# EAGLE design 2_3 (EAGLE 9.6.2)
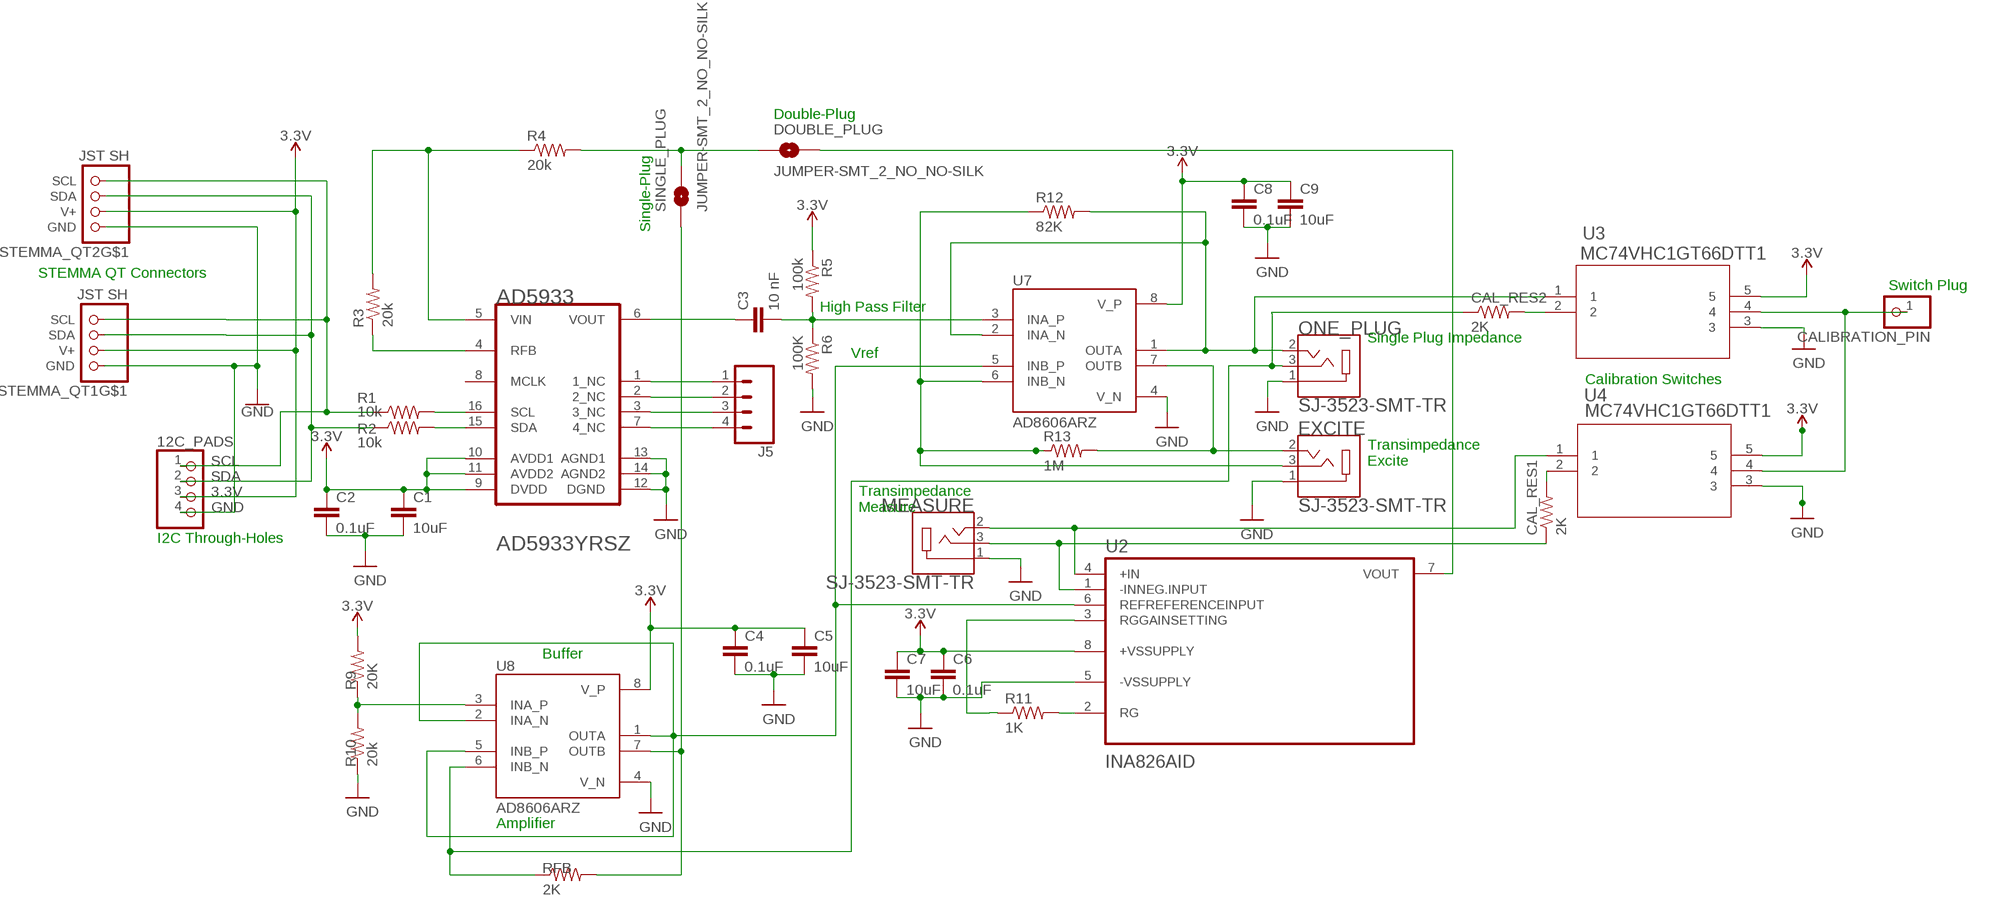
[diagram p0: schematic, sheet 1]

## Parts
12C_PADS  PINHD-1X4  [1X04]
AD5933  ANALOG_DEVICES_AD5933YRSZANALOG_DEVICES_AD5933YRSZ_0_0  [ANALOG_DEVICES_AD5933YRSZ_0]
C1  10uF  C-EUC0603  [C0603]
C2  0.1uF  C-EUC0603  [C0603]
C3  10 nF  C-EUC0603  [C0603]
C4  0.1uF  C-EUC0603  [C0603]
C5  10uF  C-EUC0603  [C0603]
C6  0.1uF  C-EUC0603  [C0603]
C7  10uF  C-EUC0603  [C0603]
C8  0.1uF  C-EUC0603  [C0603]
C9  10uF  C-EUC0603  [C0603]
CAL_RES1  2K  R-US_R0603  [R0603]
CAL_RES2  2K  R-US_R0603  [R0603]
CALIBRATION_PIN  PINHD-1X1  [1X01]
DOUBLE_PLUG  JUMPER-SMT_2_NO_NO-SILK  [SMT-JUMPER_2_NO_NO-SILK]
EXCITE  SJ-3523-SMT-TR  [CUI_SJ-3523-SMT-TR]
J5  CONN_04  [1X04]
MEASURE  SJ-3523-SMT-TR  [CUI_SJ-3523-SMT-TR]
ONE_PLUG  SJ-3523-SMT-TR  [CUI_SJ-3523-SMT-TR]
R1  10k  R-US_R0603  [R0603]
R2  10k  R-US_R0603  [R0603]
R3  20k  R-US_R0603  [R0603]
R4  20k  R-US_R0603  [R0603]
R5  100k  R-US_R0603  [R0603]
R6  100K  R-US_R0603  [R0603]
R9  20K  R-US_R0603  [R0603]
R10  20k  R-US_R0603  [R0603]
R11  1K  R-US_R0603  [R0603]
R12  82K  R-US_R0603  [R0603]
R13  1M  R-US_R0603  [R0603]
RFB  2K  R-US_R0603  [R0603]
SINGLE_PLUG  JUMPER-SMT_2_NO_NO-SILK  [SMT-JUMPER_2_NO_NO-SILK]
STEMMA_QT1  JST SH  STEMMA_I2C_QTRA  [JST_SH4_RA]
STEMMA_QT2  JST SH  STEMMA_I2C_QTRA  [JST_SH4_RA]
U2  INA826AID  [SOIC127P599X175-8N]
U3  MC74VHC1GT66DTT1  [TSOP5_1P65X3P15_ONS]
U4  MC74VHC1GT66DTT1  [TSOP5_1P65X3P15_ONS]
U7  AD8606ARZ  [SOIC127P600X175-8N]
U8  AD8606ARZ  [SOIC127P600X175-8N]

## Nets
3.3V: 12C_PADS.3 AD5933.9(DVDD) AD5933.10(AVDD1) AD5933.11(AVDD2) C1.1 C2.1 C4.1 C5.1 C6.1 C7.1 C8.1 C9.1 R5.1 R9.2 STEMMA_QT1.2(V+) STEMMA_QT2.2(V+) U2.8(+VSSUPPLY) U3.5 U4.5 U7.8(V_P) U8.8(V_P)
GND: 12C_PADS.4 AD5933.12(DGND) AD5933.13(AGND1) AD5933.14(AGND2) C1.2 C2.2 C4.2 C5.2 C6.2 C7.2 C8.2 C9.2 EXCITE.1 MEASURE.1 ONE_PLUG.1 R6.2 R10.1 STEMMA_QT1.1(GND) STEMMA_QT2.1(GND) U2.5(-VSSUPPLY) U3.3 U4.3 U7.4(V_N) U8.4(V_N)
N$1: AD5933.16(SCL) R1.2
N$2: AD5933.15(SDA) R2.2
N$3: AD5933.1(1_NC) J5.1
N$4: AD5933.2(2_NC) J5.2
N$5: AD5933.4(RFB) R3.1
N$6: AD5933.5(VIN) R3.2 R4.1
N$7: DOUBLE_PLUG.1 R4.2 SINGLE_PLUG.2
N$8: AD5933.6(VOUT) C3.1
N$9: C3.2 R5.2 R6.1 U7.3(INA_P)
N$10: AD5933.3(3_NC) J5.3
N$11: AD5933.7(4_NC) J5.4
N$12: RFB.2 SINGLE_PLUG.1 U8.7(OUTB)
N$13: U2.6(REFREFERENCEINPUT) U7.5(INB_P) U8.1(OUTA) U8.2(INA_N) U8.5(INB_P)
N$14: R9.1 R10.2 U8.3(INA_P)
N$15: ONE_PLUG.2 R12.2 U3.1 U7.1(OUTA) U7.2(INA_N)
N$16: R11.1 U2.3(RGGAINSETTING)
N$17: CAL_RES2.1 ONE_PLUG.3 RFB.1 U8.6(INB_N)
N$18: R11.2 U2.2(RG)
N$19: EXCITE.2 R13.2 U7.7(OUTB)
N$20: MEASURE.2 U2.4(+IN) U4.1
N$21: CAL_RES1.1 MEASURE.3 U2.1(-INNEG.INPUT)
N$22: CAL_RES2.2 U3.2
N$23: EXCITE.3 R12.1 R13.1 U7.6(INB_N)
N$24: CAL_RES1.2 U4.2
N$25: DOUBLE_PLUG.2 U2.7(VOUT)
N$27: CALIBRATION_PIN.1 U3.4 U4.4
SCL: 12C_PADS.1 R1.1 STEMMA_QT1.4(SCL) STEMMA_QT2.4(SCL)
SDA: 12C_PADS.2 R2.1 STEMMA_QT1.3(SDA) STEMMA_QT2.3(SDA)
Unconnected: AD5933.8(MCLK) STEMMA_QT1.MT1(MT) STEMMA_QT1.MT2(MT) STEMMA_QT2.MT1(MT) STEMMA_QT2.MT2(MT)

## Notes on the sheet
- Double-Plug
- Single-Plug
- STEMMA QT Connectors
- Switch Plug
- High Pass Filter
- Single Plug Impedance
- Vref
- Calibration Switches
- Transimpedance
  Excite
- Transimpedance
  Measure
- I2C Through-Holes
- Buffer
- Amplifier

## Library data of the parts
12C_PADS = pinhead:PINHD-1X4: PIN HEADER
AD5933 = Analog Devices - AD5933YRSZ:ANALOG_DEVICES_AD5933YRSZ: ADI-AD5933-RS-16; CIIVA_IDS: 19299999; CODE__JEDEC: MO-150-AC; COMPONENT_LINK_1_DESCRIPTION: Manufacturer URL; COMPONENT_LINK_1_URL: www.analog.com; COMPONENT_LINK_3_DESCRIPTION: Package Specification; COMPONENT_LINK_3_URL: http://www.analog.com/static/imported-files/packages/31572257652246RS_16.pdf; DATASHEET: http://www.analog.com/static/imported-files/data_sheets/AD5933.pdf; DATASHEET_VERSION: Rev. D; FOOTPRINT_VARIANT_NAME_0: Level C; FOOTPRINT_VARIANT_NAME_1: Level B; FOOTPRINT_VARIANT_NAME_2: Level A; IMPORTED: yes; IMPORTED_FROM: vault; IMPORT_TS: 1521848033; IO_INTERFACE: Serial; I_SUPPLY_TOTAL_MAX: 15mA; MASTER_FCLK: 16.776MHz; MF: Analog Devices; MPN: AD5933YRSZ; PACKAGE: RS-16; PACKAGE_DESCRIPTION: 16-Lead Shrink Small Outline Package [SSOP]; PACKAGE_VERSION: 3/17/2005; PIN_0_0_15_INSIDE_EDGE: clock; PIN_0_0_7_INSIDE_EDGE: clock; PREFIX: U; RELEASE_DATE: 1333437714; RESOLUTION_BITS: 12bit; TUNING_WORD_WIDTH_BITS: 27bit; VAULT_GUID: 12E548FF-7E75-4596-9B3A-06B167E4919E; VAULT_REVISION: 0B288880-7FBC-46A2-8187-17CED40A7223
C1-C9 = rcl:C-EU: CAPACITOR, European symbol; SPICEPREFIX: C
CAL_RES1 CAL_RES2 R1-R6 R9-R13 RFB = rcl:R-US_: RESISTOR, American symbol; SPICEPREFIX: R
CALIBRATION_PIN = pinhead:PINHD-1X1: PIN HEADER
DOUBLE_PLUG SINGLE_PLUG = SparkFun-Jumpers:JUMPER-SMT_2_NO: Normally open jumper This jumper has two pads in close proximity to each other. Apply solder to close the connection. Round pads are easier to solder for beginners, but are a lot larger. SparkFun Product that uses the round pads: SparkFun EL Sequencer <https://www.sparkfun.com/products/12781>
EXCITE MEASURE ONE_PLUG = SJ-3523-SMT-TR:SJ-3523-SMT-TR: Audio Jack Connector 3.5 mm Low Profile Surface Mount Stereo Jack, 3 Pin Right-Angle Check availability <https://pricing.snapeda.com/parts/SJ-3523-SMT-TR/CUI%20Devices/view-part?ref=eda>; AVAILABILITY: In Stock; CUI_PURCHASE_URL: https://www.cuidevices.com/product/interconnect/connectors/audio-connectors/jacks/sj-352x-smt-series?utm_source=snapeda.com&utm_medium=referral&utm_campaign=snapedaBOM; DESCRIPTION: 3.5 mm, Stereo, Right Angle, Surface Mount (SMT), 3 Conductors, 0~1 Internal Switches, Audio Jack Connector; MF: CUI Devices; MP: SJ-3523-SMT-TR; PACKAGE: None; PRICE: None; PURCHASE-URL: https://pricing.snapeda.com/search/part/SJ-3523-SMT-TR/?ref=eda
J5 = SparkFun-Connectors:CONN_04: Multi connection point. Often used as Generic Header-pin footprint for 0.1 inch spaced/style header connections On any of the 0.1 inch spaced packages, you can populate with these: Break Away Headers - Straight <https://www.sparkfun.com/products/116> (PRT-00116) Break Away Male Headers - Right Angle <https://www.sparkfun.com/products/553> (PRT-00553) Female Headers <https://www.sparkfun.com/products/115> (PRT-00115) Break Away Headers - Machine Pin <https://www.sparkfun.com/products/117> (PRT-00117) Break Away Female Headers - Swiss Machine Pin <https://www.sparkfun.com/products/743> (PRT-00743) For SCREWTERMINALS and SPRING TERMINALS visit here: Screw Terimnals on SparkFun.com <https://www.sparkfun.com/search/results?term=Screw+Terminals> (5mm/3.5mm/2.54mm spacing) This device is also useful as a general connection point to wire up your design to another part of your project. Our various solder wires solder well into these plated through hole pads. Hook-Up Wire - Assortment (Stranded, 22 AWG) <https://www.sparkfun.com/products/11375> (PRT-11375) Hook-Up Wire - Assortment (Solid Core, 22 AWG) <https://www.sparkfun.com/products/11367> (PRT-11367) View the entire wire category on our website here <https://www.sparkfun.com/categories/141> Special notes: Molex polarized connector foot print use with SKU : PRT-08231 with associated crimp pins and housings. 1MM SMD Version SKU: PRT-10208; PROD_ID: CONN-09696
STEMMA_QT1 STEMMA_QT2 = microbuilder:STEMMA_I2C
U2 = INA826AID:INA826AID: Check availability <https://pricing.snapeda.com/parts/INA826AID/Texas%20Instruments/view-part?ref=eda>; AVAILABILITY: In Stock; CHECK_PRICES: https://www.snapeda.com/parts/INA826AID/Texas+Instruments/view-part/?ref=eda; DESCRIPTION: Precision, 200-μA Supply Current, 36-V Supply Instrumentation Amplifier; MF: Texas Instruments; MP: INA826AID; PACKAGE: SOIC-8 Texas Instruments; PRICE: None; PURCHASE-URL: https://www.snapeda.com/api/url_track_click_mouser/?unipart_id=217743&manufacturer=Texas Instruments&part_name=INA826AID&search_term=None; SNAPEDA_LINK: https://www.snapeda.com/parts/INA826AID/Texas+Instruments/view-part/?ref=snap
U3 U4 = MC74VHC1GT66DTT1:MC74VHC1GT66DTT1; COPYRIGHT: Copyright (C) 2024 Ultra Librarian. All rights reserved.; MANUFACTURER_PART_NUMBER: MC74VHC1GT66DTT1; MFR_NAME: onsemi
U7 U8 = AD8606ARZ:AD8606ARZ: Operational amplifier; 10MHz; 2.7÷5VDC; Channels: 2; SO8 Check availability <https://pricing.snapeda.com/parts/AD8606ARZ/Analog%20Devices/view-part?ref=eda>; AVAILABILITY: In Stock; CHECK_PRICES: https://www.snapeda.com/parts/AD8606ARZ/Analog+Devices/view-part/?ref=eda; DESCRIPTION: Precision, Low Noise, RRIO, CMOS Op Amp (Dual); MF: Analog Devices; MP: AD8606ARZ; PACKAGE: SOIC-8 Analog Devices; PRICE: None; PURCHASE-URL: https://www.snapeda.com/api/url_track_click_mouser/?unipart_id=43414&manufacturer=Analog Devices&part_name=AD8606ARZ&search_term=None; SNAPEDA_LINK: https://www.snapeda.com/parts/AD8606ARZ/Analog+Devices/view-part/?ref=snap

## Board
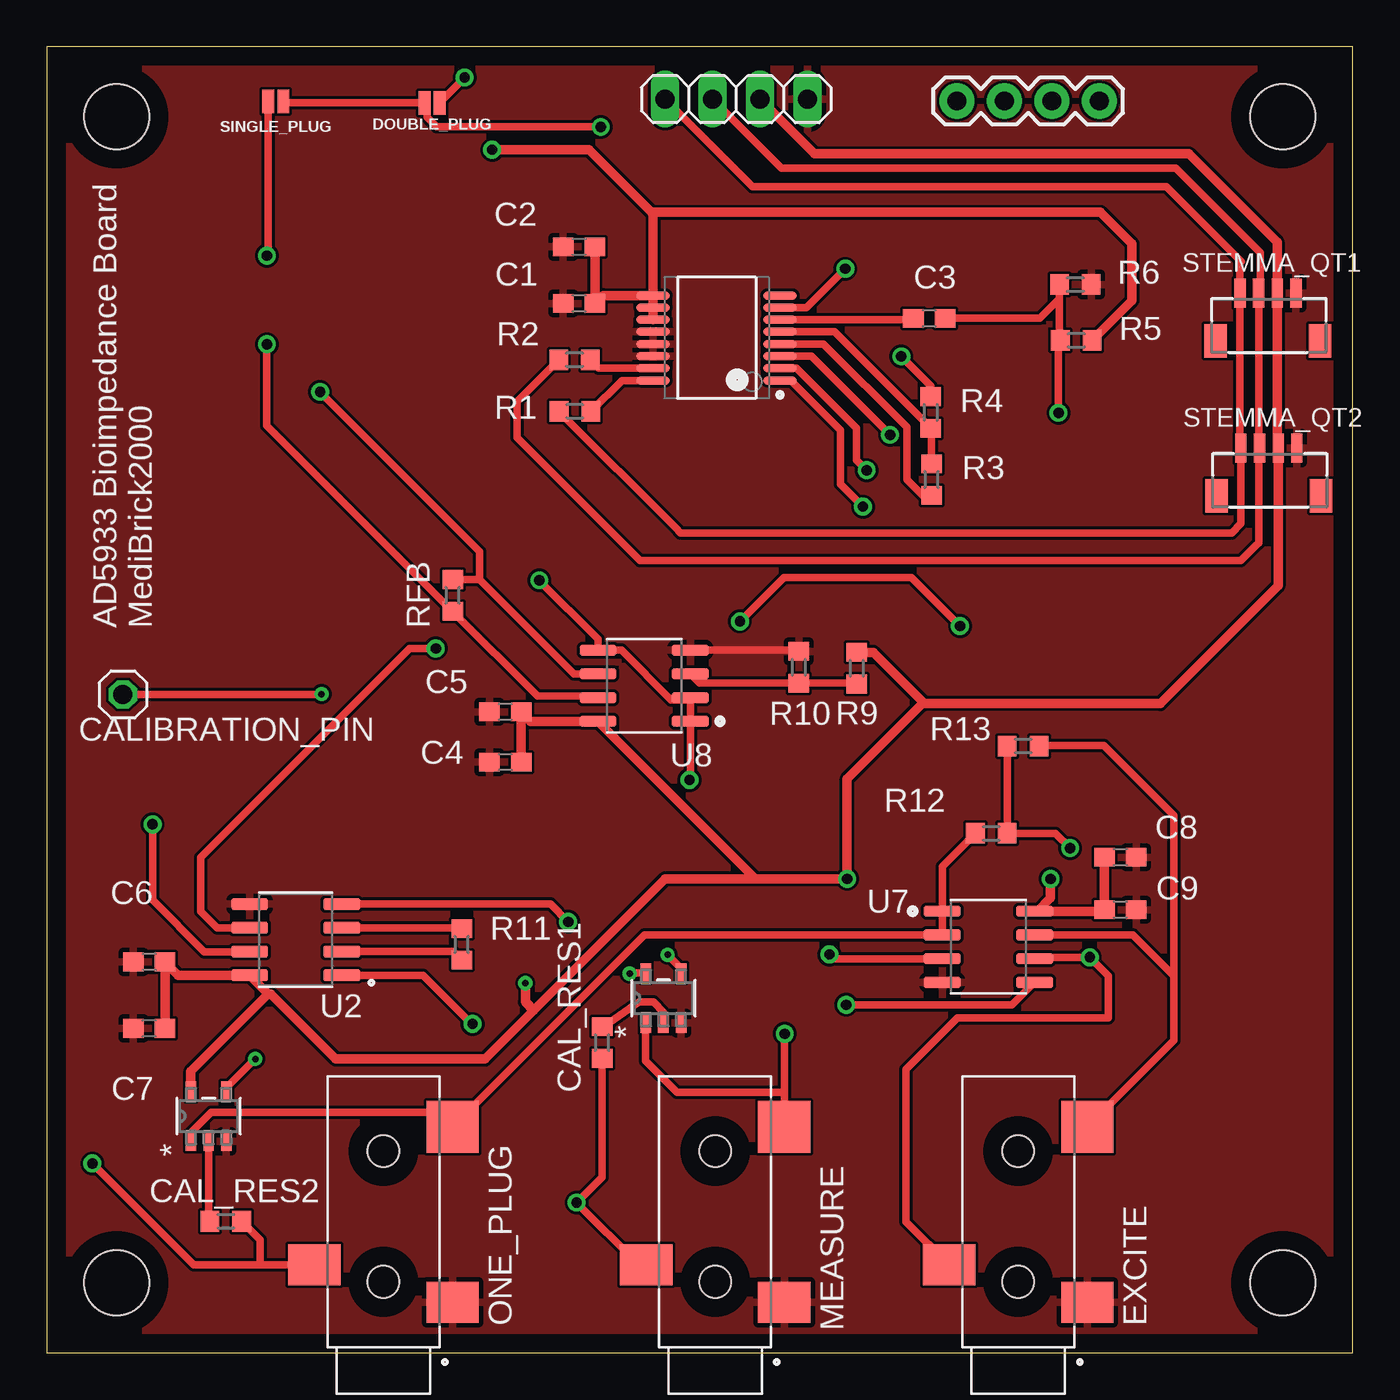
[diagram p1: board, top side]
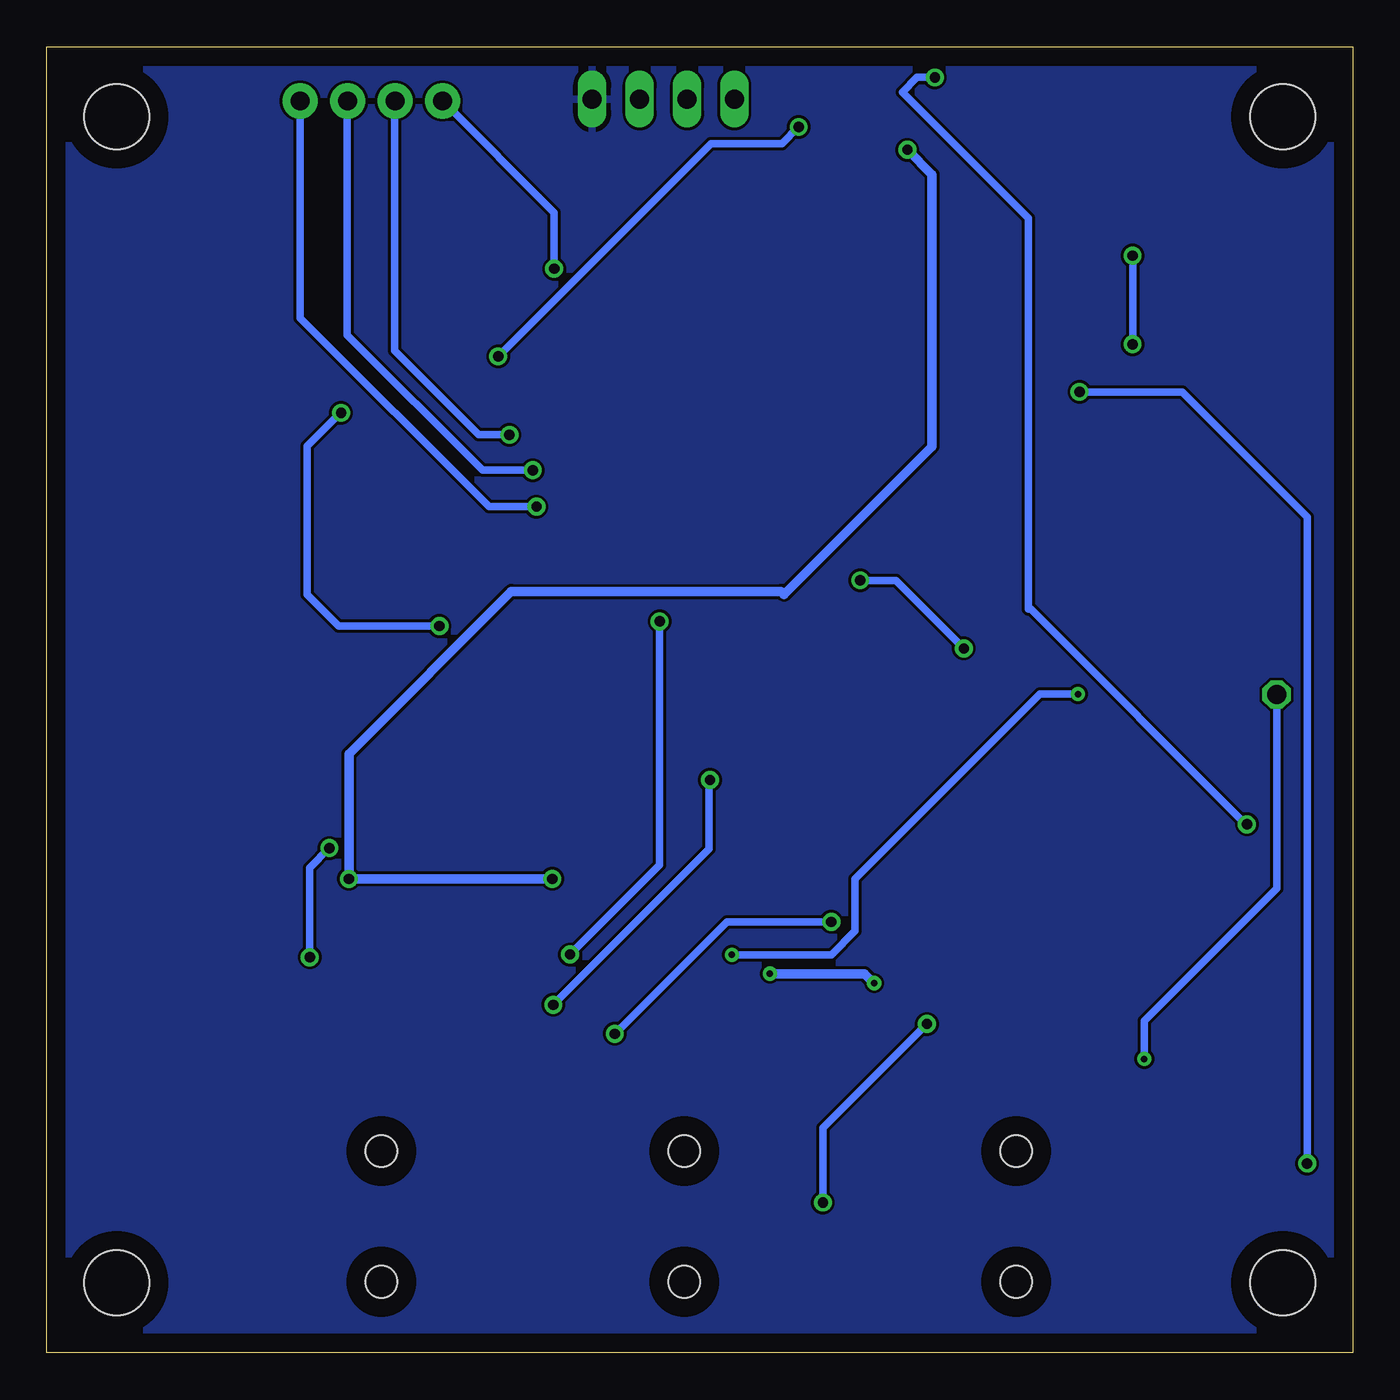
[diagram p2: board, bottom side, seen from below]

Size 70 x 70 mm. Coordinates in mm from the lower left corner, seen from the top.
Outline: 0,0 70,0 70,70 0,70 0,0
Copper layers (1*16): Top 0.035mm / dielectric 1.5mm / Bottom 0.035mm
Design rules "default": minimum track width 6mil, minimum drill 0.35mm, track to track 6mil, track to pad 6mil, pad to pad 6mil, via to via 6mil, smd to smd 6mil, copper to edge 40mil, drill to drill 6mil, minimum pad ring 10mil, minimum via ring 8mil, stop-mask expansion 4mil, vias tented up to drill 0mil, thermal gap 10mil
Holes 3.5 mm at 3.75,66.25 66.25,66.25 3.75,3.75 66.25,3.75

### Footprints (pad centres in the part's own frame; a part is rotated, then mirrored left to right if it is on the bottom)
1X04 = drill 1.016 long: 1 -3.81,0; 2 -1.27,0; 3 1.27,0; 4 3.81,0
ANALOG_DEVICES_AD5933YRSZ_0 = smd 1.8 x 0.45: 1 -3.4,2.275; 2 -3.4,1.625; 3 -3.4,0.975; 4 -3.4,0.325; 5 -3.4,-0.325; 6 -3.4,-0.975; 7 -3.4,-1.625; 8 -3.4,-2.275; 9 3.4,-2.275; 10 3.4,-1.625; 11 3.4,-0.975; 12 3.4,-0.325; 13 3.4,0.325; 14 3.4,0.975; 15 3.4,1.625; 16 3.4,2.275
C0603 = smd 1.1 x 1: 1 -0.85,0; 2 0.85,0
R0603 = smd 1 x 1.1: 1 -0.85,0; 2 0.85,0
1X01 = drill 1.016 octagon: 1 0,0
SMT-JUMPER_2_NO_NO-SILK = smd 0.635 x 1.27: 1 -0.406,0; 2 0.406,0
CUI_SJ-3523-SMT-TR = smd 2.2 x 2.8: 1 -1.1,-3.7; 3 0.9,3.7 | smd 2.8 x 2.8: 2 8.3,-3.7 | hole 1.7: 0,0; 7,0
1X04' = drill 1.016 pad 1.88: 1 0,0; 2 2.54,0; 3 5.08,0; 4 7.62,0
JST_SH4_RA = smd 0.6 x 1.55: 1 1.5,1.686; 2 0.5,1.686; 3 -0.5,1.686; 4 -1.5,1.686 | smd 1.2 x 1.8: MT1 -2.8,-0.862; MT2 2.8,-0.862
SOIC127P599X175-8N = smd 1.97 x 0.6: 1 -2.47,1.905; 2 -2.47,0.635; 3 -2.47,-0.635; 4 -2.47,-1.905; 5 2.47,-1.905; 6 2.47,-0.635; 7 2.47,0.635; 8 2.47,1.905
TSOP5_1P65X3P15_ONS = smd 1.029 x 0.559: 1 -1.34,0.95; 2 -1.34,0; 3 -1.34,-0.95; 4 1.34,-0.95; 5 1.34,0.95
SOIC127P600X175-8N = smd 1.97 x 0.6: 1 -2.475,1.905; 2 -2.475,0.635; 3 -2.475,-0.635; 4 -2.475,-1.905; 5 2.475,-1.905; 6 2.475,-0.635; 7 2.475,0.635; 8 2.475,1.905

### Placement (x,y rotation side)
12C_PADS  36.95,67.19 0 top
AD5933  35.9,54.39 180 top
C1  28.53,56.24 180 top
C2  28.53,59.27 180 top
C3  47.3,55.44 0 top
C4  24.58,31.66 180 top
C5  24.58,34.35 180 top
C6  5.49,20.95 180 top
C7  5.49,17.39 180 top
C8  57.54,26.56 0 top
C9  57.54,23.75 0 top
CAL_RES1  29.77,16.63 90 top
CAL_RES2  9.6,7.05 180 top
CALIBRATION_PIN  4.09,35.28 0 top
DOUBLE_PLUG  20.66,66.99 0 top
EXCITE  52.07,3.81 90 top
J5  [1X04']  56.41,67.09 180 top
MEASURE  35.83,3.81 90 top
ONE_PLUG  18.05,3.81 90 top
R1  28.31,50.45 0 top
R2  28.29,53.21 0 top
R3  47.42,46.8 90 top
R4  47.38,50.4 90 top
R5  55.18,54.26 180 top
R6  55.13,57.25 0 top
R9  43.41,36.69 90 top
R10  40.31,36.74 270 top
R11  22.24,21.89 270 top
R12  50.62,27.84 180 top
R13  52.33,32.52 0 top
RFB  21.76,40.59 270 top
SINGLE_PLUG  12.28,67.06 0 top
STEMMA_QT1  65.45,55.1 0 top
STEMMA_QT2  65.5,46.8 0 top
U2  13.35,22.14 180 top
U3  8.68,12.68 90 top
U4  33.05,19.01 90 top
U7  50.47,21.76 0 top
U8  32.02,35.75 180 top

### Tracks (layer width: path | path; a pad name or v marks a point on that pad's centre or on a via)
3.3V  (via drill 0.35, 0.55)
  Top 0.406: AD5933.9 AD5933.10 AD5933.11 | 53.09,23.66 U7.8 | 32.5,61.05 32.42,61.13 | U4.5 31.28,20.35 v31.24,20.32 | 42.9,25.65 v42.9,25.4
  Top 0.508: C4.1 C5.1 25.93,33.84 U8.8 37.99,25.4 | 37.99,25.4 42.65,25.4 42.9,25.65 | 37.99,25.4 33.15,25.4 26.1,18.35 | v25.65,19.81 25.65,18.8 26.1,18.35 | 11.87,19.24 12,19.24 15.49,15.75 23.5,15.75 26.1,18.35 | 11.87,19.24 U2.8 7.05,20.23 C6.1 C7.1 | U3.5 7.73,15.1 11.87,19.24 | 47.04,34.8 59.69,34.8 66,41.11 STEMMA_QT2.2 65.95,48.54 STEMMA_QT1.2 65.95,59.53 61.21,64.26 41.15,64.26 12C_PADS.3 | R9.2 44.3,37.54 47.04,34.8 | 47.04,34.8 46.94,34.8 42.9,30.76 v42.9,25.4 | R5.1 58.17,56.4 58.17,59.44 56.48,61.13 32.42,61.13 29.07,64.47 v23.88,64.47 | 32.5,61.05 AD5933.9 | AD5933.9 29.8,56.66 C1.1 C2.1 | AD5933.9 AD5933.11 | v53.8,25.4 53.8,24.38 53.09,23.66 | U7.8 56.6,23.66 C9.1 C8.1
  Bottom 0.508: v42.9,25.4 v53.8,25.4 53.8,32.1 45.1,40.8 30.64,40.8 30.48,40.64 22.55,48.57 22.55,63.15 v23.88,64.47 | v25.65,19.81 26.16,20.32 v31.24,20.32
GND
  Top 0.406: U8.4 40.24,37.66 R10.1
  pour Top: 0,69.85 0,0 69.85,0 69.85,69.85
  pour Bottom: 0,69.85 0,0 69.85,0 69.85,69.85
N$1
  Top 0.406: AD5933.16 30.82,52.12 R1.2
N$2
  Top 0.406: AD5933.15 29.59,52.77 R2.2
N$3  (via drill 0.55)
  Top 0.406: AD5933.1 39.88,52.12 42.55,49.45 42.55,46.55 v43.75,45.35
  Bottom 0.406: v43.75,45.35 46.3,45.35 56.41,55.46 J5.1
N$4  (via drill 0.55)
  Top 0.406: AD5933.2 40.19,52.77 43.4,49.55 43.4,47.85 v43.95,47.3
  Bottom 0.406: v43.95,47.3 46.65,47.3 53.9,54.55 53.9,67.06 J5.2
N$5
  Top 0.406: AD5933.4 41.63,54.06 46.1,49.6 46.1,46.8 46.95,45.95 R3.1
N$6
  Top 0.406: R3.2 47.42,49.51 R4.1 42.22,54.72 AD5933.5
N$7  (via drill 0.55)
  Top 0.406: SINGLE_PLUG.2 12.76,66.99 DOUBLE_PLUG.1 20.39,66.85 20.39,66.21 20.9,65.7 v29.7,65.7 | R4.2 47.38,51.82 v45.8,53.4
  Bottom 0.406: v45.8,53.4 34.4,64.8 30.6,64.8 v29.7,65.7
N$8
  Top 0.406: AD5933.6 46.38,55.37 C3.1
N$9  (via drill 0.55)
  Top 0.406: R6.1 54.28,56.5 | 54.28,56.5 54.28,54.31 R5.2 54.23,54.16 v54.23,50.38 | C3.2 53.22,55.44 54.28,56.5 | U7.3 42.17,21.12 v41.95,21.35 | v37.15,39.2 39.5,41.55 46.35,41.55 v48.95,38.95
  Bottom 0.406: v41.95,21.35 37.15,26.15 v37.15,39.2 | v48.95,38.95 54.35,38.95 56.05,40.65 56.05,48.6 54.25,50.4 v54.23,50.38
N$10  (via drill 0.55)
  Top 0.406: AD5933.3 40.98,53.41 v45.2,49.2
  Bottom 0.406: v45.2,49.2 46.85,49.2 51.35,53.7 51.35,67.07 J5.3
N$11  (via drill 0.55)
  Top 0.406: AD5933.7 40.72,56.02 v42.8,58.1
  Bottom 0.406: v42.8,58.1 42.8,61.1 J5.4
N$12  (via drill 0.55)
  Top 0.406: v11.8,54.05 11.8,49.7 RFB.2 26.3,35.2 29.46,35.2 U8.7 | v11.8,58.8 11.87,58.87 SINGLE_PLUG.1
  Bottom 0.406: v11.8,54.05 v11.8,58.8
N$13  (via drill 0.55)
  Top 0.406: U7.5 51.74,18.65 v42.85,18.65 | U2.6 9.12,22.77 8.25,23.65 8.25,26.55 19.45,37.75 v20.85,37.75 | v26.4,41.4 29.55,38.26 U8.5 30.8,37.66 33.45,35 34.49,35 U8.2 U8.1 34.49,30.75 v34.45,30.7
  Bottom 0.406: v42.85,18.65 34.5,27 34.5,30.7 v34.45,30.7 | v20.85,37.75 24.5,41.4 v26.4,41.4
N$14
  Top 0.406: R9.1 43.36,35.89 40.64,35.89 R10.2 34.99,35.89 U8.3
N$15
  Top 0.406: R12.2 47.99,26.07 U7.1 U7.2 32.03,22.39 ONE_PLUG.2 20.98,12.88 8.81,12.88 7.73,11.8 U3.1
N$16
  Top 0.406: U2.3 22.2,22.77 R11.1
N$17  (via drill 0.55)
  Top 0.406: RFB.1 23.21,41.44 | U8.6 28.27,36.38 23.21,41.44 | 23.21,41.44 23.21,42.94 v14.65,51.5 | v2.45,10.15 7.89,4.71 11.43,4.71 | 11.43,4.71 ONE_PLUG.3 | CAL_RES2.1 11.43,6.07 11.43,4.71
  Bottom 0.406: v14.65,51.5 9.15,51.5 2.45,44.8 v2.45,10.15
N$18
  Top 0.406: U2.2 21.77,21.5 R11.2
N$19
  Top 0.406: U7.7 58.2,22.39 60.4,20.2 | 60.4,20.2 60.4,16.74 EXCITE.2 | 60.4,20.2 60.4,28.8 56.65,32.55 53.21,32.55 R13.2
N$20  (via drill 0.55)
  Top 0.406: U2.4 27,24.05 v27.95,23.1 | v39.55,17.1 39.55,13.97 | 39.55,13.97 39.55,12.13 MEASURE.2 | 39.55,13.97 33.78,13.97 32.1,15.65 U4.1
  Bottom 0.406: v27.95,23.1 33.55,23.1 v39.55,17.1
N$21  (via drill 0.55)
  Top 0.406: U2.1 20.16,20.23 22.8,17.6 v22.82,17.62 | MEASURE.3 31.74,4.71 v28.4,8.05 29.77,9.42 CAL_RES1.1
  Bottom 0.406: v22.82,17.62 28.4,12.05 v28.4,8.05
N$22
  Top 0.406: U3.2 8.68,7.12 CAL_RES2.2
N$23  (via drill 0.55)
  Top 0.406: R13.1 R12.1 54.06,27.84 v54.85,27.05 | U7.6 53.02,21.2 v55.9,21.2 56.9,20.2 56.9,17.95 48.8,17.95 46.05,15.2 46.05,7.03 EXCITE.3
  Bottom 0.406: v54.85,27.05 55.9,26 v55.9,21.2
N$24
  Top 0.406: CAL_RES1.2 29.86,17.48 31.75,18.8 32.51,18.8 33.05,18.26 U4.2
N$25  (via drill 0.55)
  Top 0.406: DOUBLE_PLUG.2 22.4,68.32 v22.4,68.35 | v5.67,28.32 5.67,24.27 8.45,21.5 U2.7
  Bottom 0.406: v22.4,68.35 23.35,68.35 24.15,67.55 17.4,60.8 17.4,39.85 17.25,39.85 5.7,28.3 v5.67,28.32
N$27  (via drill 0.35)
  Top 0.406: U4.4 34,20.61 v33.27,21.34 | v14.73,35.31 14.71,35.28 CALIBRATION_PIN.1 | U3.4 9.63,14.2 v11.18,15.75
  Bottom 0.406: v33.27,21.34 27.94,21.34 26.67,22.61 26.67,25.4 16.76,35.31 v14.73,35.31 | v11.18,15.75 11.18,17.78 4.06,24.89 4.06,35.26 CALIBRATION_PIN.1
SCL
  Top 0.406: 12C_PADS.1 37.83,62.5 60,62.5 64.03,58.47 63.95,58.39 STEMMA_QT1.4 63.95,48.54 STEMMA_QT2.4 64.01,48.48 64.01,44.45 63.5,43.94 33.97,43.94 33.91,44 33.75,44.16 R1.1
SDA
  Top 0.406: 12C_PADS.2 39.37,63.5 60.5,63.5 65.03,58.97 65.03,56.87 STEMMA_QT1.3 64.95,48.54 | R2.1 25.2,50.97 25.2,49.05 31.8,42.45 64,42.45 64.62,43.07 64.83,43.28 64.95,43.4 64.95,48.54 | 64.95,48.54 STEMMA_QT2.3

### Text on the board
tNames: AD5933 Bioimpedance Board / MediBrick2000